# EAGLE design ledterne_driver (EAGLE 7.3.0)
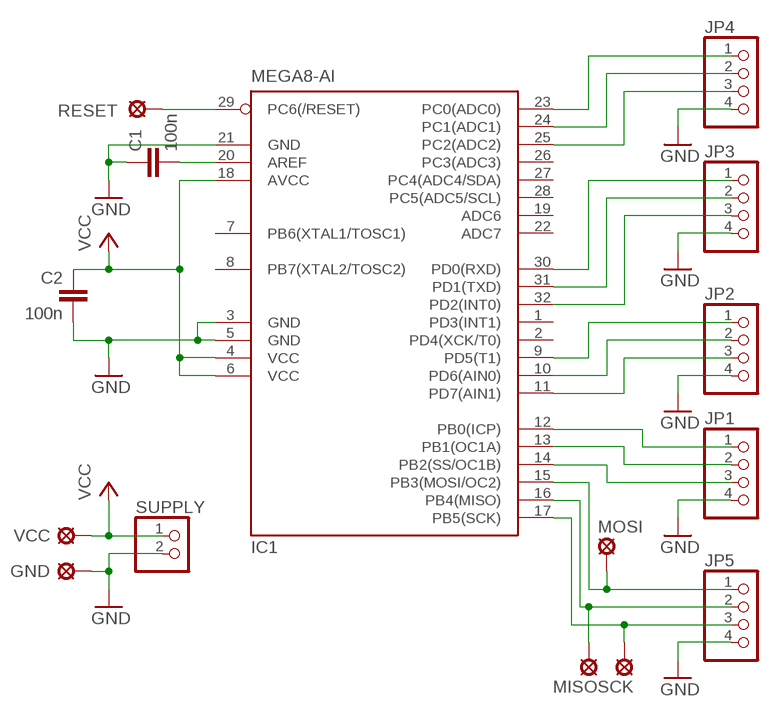
[diagram p0: schematic, sheet 1]

## Parts
C1  100n  C-EUC0805K  [C0805K]
C2  100n  C-EUC0805K  [C0805K]
GND  LSP10  [LSP10]
IC1  MEGA8-AI  [TQFP32-08]
JP1  PINHD-1X4/90  [1X04/90]
JP2  PINHD-1X4/90  [1X04/90]
JP3  PINHD-1X4/90  [1X04/90]
JP4  PINHD-1X4/90  [1X04/90]
JP5  PINHD-1X4/90  [1X04/90]
MISO  LSP10  [LSP10]
MOSI  LSP10  [LSP10]
RESET  LSP10  [LSP10]
SCK  LSP10  [LSP10]
SUPPLY  PINHD-1X2  [1X02]
VCC  LSP10  [LSP10]

## Nets
GND: C1.1 C2.2 GND.MP IC1.3(GND) IC1.5(GND) IC1.21(GND) JP1.4 JP2.4 JP3.4 JP4.4 JP5.4 SUPPLY.2
MISO: IC1.16(PB4(MISO)) JP5.2 MISO.MP
MOSI: IC1.15(PB3(MOSI/OC2)) JP5.1 MOSI.MP
N$1: C1.2 IC1.20(AREF)
N$3: IC1.14(PB2(SS/OC1B)) JP1.3
N$4: IC1.13(PB1(OC1A)) JP1.2
N$5: IC1.12(PB0(ICP)) JP1.1
N$6: IC1.11(PD7(AIN1)) JP2.3
N$7: IC1.10(PD6(AIN0)) JP2.2
N$8: IC1.9(PD5(T1)) JP2.1
N$9: IC1.30(PD0(RXD)) JP3.1
N$10: IC1.31(PD1(TXD)) JP3.2
N$11: IC1.32(PD2(INT0)) JP3.3
N$12: IC1.23(PC0(ADC0)) JP4.1
N$13: IC1.24(PC1(ADC1)) JP4.2
N$15: IC1.25(PC2(ADC2)) JP4.3
RESET: IC1.29(PC6(/RESET)) RESET.MP
SCK: IC1.17(PB5(SCK)) JP5.3 SCK.MP
VCC: C2.1 IC1.4(VCC) IC1.6(VCC) IC1.18(AVCC) SUPPLY.1 VCC.MP
Unconnected: IC1.1(PD3(INT1)) IC1.2(PD4(XCK/T0)) IC1.7(PB6(XTAL1/TOSC1)) IC1.8(PB7(XTAL2/TOSC2)) IC1.19(ADC6) IC1.22(ADC7) IC1.26(PC3(ADC3)) IC1.27(PC4(ADC4/SDA)) IC1.28(PC5(ADC5/SCL))

## Library data of the parts
C1 C2 = rcl:C-EU: CAPACITOR, European symbol
GND MISO MOSI RESET SCK VCC = solpad-ledterne:LSP10
IC1 = atmel:MEGA8: MICROCONTROLLER 8 Kbytes FLASH, 1 kbytes SRAM, 512 bytes EEPROM, USART, 6-channel 10 bit ADC, 2-channel 8 bit ADC Pin compatible with Atmega48, ATMega88, ATMega168 Source: avr.lbr; MPN: ATMEGA8-16AU; OC_FARNELL: 9171371; OC_NEWARK: 73M8863
JP1-JP5 = pinhead_round_pads:PINHD-1X4: PIN HEADER
SUPPLY = pinhead:PINHD-1X2: PIN HEADER

## Board
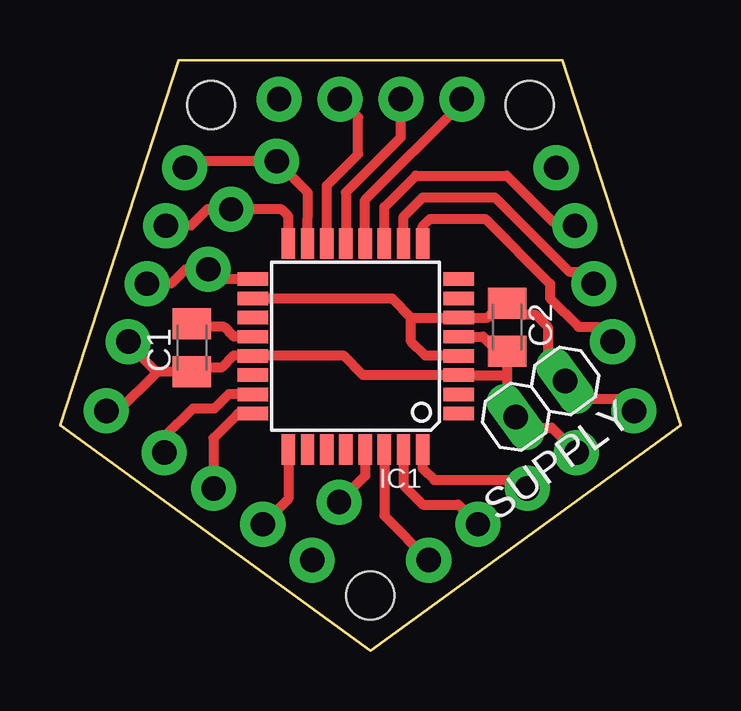
[diagram p1: board, top side]
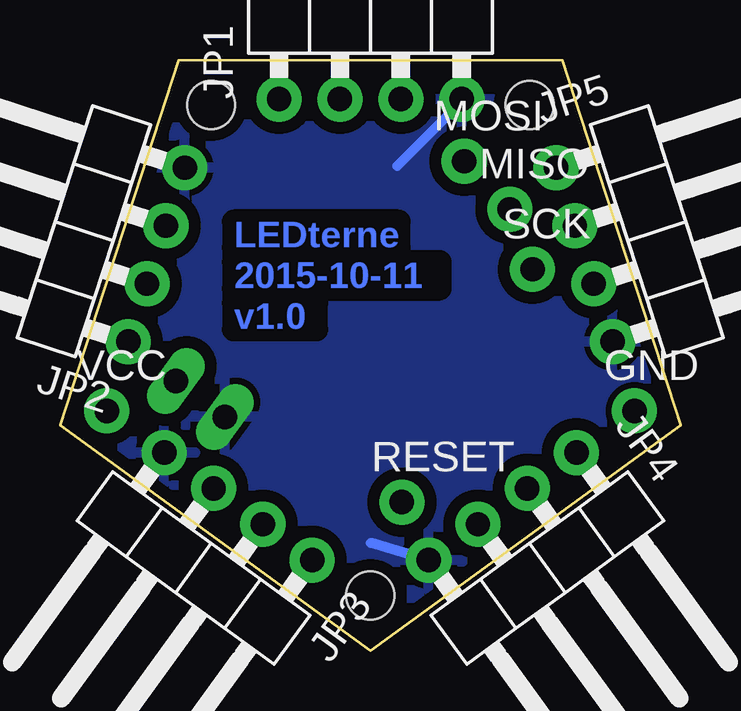
[diagram p2: board, bottom side, seen from below]

Size 25.89 x 24.62 mm. Coordinates in mm from the lower left corner, seen from the top.
Outline: 12.94,0 25.89,9.4 20.94,24.62 4.94,24.62 0,9.4 12.94,0
Copper layers (1*16): Top 0.035mm / dielectric 1.5mm / Bottom 0.035mm
Design rules "default *": minimum track width 10mil, minimum drill 24mil, track to track 8mil, track to pad 8mil, pad to pad 8mil, via to via 8mil, smd to smd 8mil, copper to edge 15mil, drill to drill 8mil, minimum pad ring 10mil, minimum via ring 8mil, stop-mask expansion 4mil, vias tented up to drill 0mil, thermal gap 10mil
Holes 2 mm at 19.59,22.75 12.94,2.31 6.3,22.75
bRestrict: area 1.2,9.3 to 2.6,10.7; area 5.5,15.2 to 6.9,16.6; area 6.4,17.7 to 7.8,19.1; area 8.3,19.7 to 9.7,21.1; area 10.9,5.5 to 12.3,6.9; area 23.2,9.3 to 24.6,10.7

### Footprints (pad centres in the part's own frame; a part is rotated, then mirrored left to right if it is on the bottom)
C0805K = smd 1.3 x 1.6: 1 -1,0; 2 1,0
LSP10 = drill 1.016 pad 1.88: MP 0,0
TQFP32-08 = smd 1.27 x 0.559: 1 -4.293,2.8; 2 -4.293,2; 3 -4.293,1.2; 4 -4.293,0.4; 5 -4.293,-0.4; 6 -4.293,-1.2; 7 -4.293,-2; 8 -4.293,-2.8; 17 4.293,-2.8; 18 4.293,-2; 19 4.293,-1.2; 20 4.293,-0.4; 21 4.293,0.4; 22 4.293,1.2; 23 4.293,2; 24 4.293,2.8 | smd 0.559 x 1.27: 9 -2.8,-4.293; 10 -2,-4.293; 11 -1.2,-4.293; 12 -0.4,-4.293; 13 0.4,-4.293; 14 1.2,-4.293; 15 2,-4.293; 16 2.8,-4.293; 25 2.8,4.293; 26 2,4.293; 27 1.2,4.293; 28 0.4,4.293; 29 -0.4,4.293; 30 -1.2,4.293; 31 -2,4.293; 32 -2.8,4.293
1X04/90 = drill 1.016 pad 1.88: 1 -3.81,-3.81; 2 -1.27,-3.81; 3 1.27,-3.81; 4 3.81,-3.81
1X02 = drill 1.016 long: 1 -1.27,0; 2 1.27,0

### Placement (x,y rotation side)
C1  5.5,12.63 90 top
C2  18.64,13.49 270 top
GND  1.93,10 0 bottom
IC1  12.32,12.69 180 top
JP1  12.94,26.8 0 bottom
JP2  25.49,17.69 72 bottom
JP3  20.7,2.94 144 bottom
JP4  5.19,2.94 216 bottom
JP5  0.4,17.69 288 bottom
MISO  7.13,18.4 0 bottom
MOSI  9.03,20.4 0 bottom
RESET  11.63,6.2 0 bottom
SCK  6.18,15.9 0 bottom
SUPPLY  20.03,10.5 216 top
VCC  23.93,10 0 bottom

### Tracks (layer width: path | path; a pad name or v marks a point on that pad's centre or on a via)
GND
  Top 0.406: 18.64,11.4 C2.2 18.56,12.7 18.03,12.7 17.64,13.09 IC1.5 | 18.64,11.4 18.64,10.12 SUPPLY.2 19.46,9.3 20.5,9.3 JP3.4 | 18.64,11.4 18.55,11.49 IC1.3 12.64,11.49 11.84,12.29 IC1.21 7.22,12.29 6.73,11.8 6.23,11.8 6.03,12 5.75,12 C1.1 4,11.63 | GND.MP 2.43,10 4.03,11.6 4,11.63 | 2.83,12.8 4,11.63
  Bottom 0.406: JP1.4 9.13,22.9 11.83,20.2 | JP4.4 12.93,4.5
  pour Bottom (isolate 0.5): 4.93,24.6 20.93,24.6 25.83,9.5 12.93,0 0.03,9.4
MISO
  Top 0.406: IC1.16 9.52,18.11 9.23,18.4 MISO.MP 6.13,18.4 5.45,17.72 JP5.2
MOSI
  Top 0.406: JP5.1 5.49,20.4 MOSI.MP 10.33,19.08 IC1.15
N$1
  Top 0.406: 5.82,13.29 C1.2 5.63,13.5 6.83,13.5 7.24,13.09 IC1.20
N$3
  Top 0.406: IC1.14 11.12,19.39 12.43,20.7 12.43,22.23 JP1.3
N$4
  Top 0.406: IC1.13 11.92,19.11 14.21,21.4 JP1.2
N$5
  Top 0.406: IC1.12 12.72,18.79 16.75,22.82 JP1.1
N$6
  Top 0.406: IC1.11 13.52,18.49 14.83,19.8 18.63,19.8 20.53,17.9 21.29,17.9 JP2.3
N$7
  Top 0.406: IC1.10 14.32,18.09 15.13,18.9 18.13,18.9 21.23,15.8 21.76,15.8 JP2.2
N$8
  Top 0.406: IC1.9 15.12,17.69 15.43,18 17.73,18 20.43,15.3 20.43,14.7 21.63,13.5 22.43,13.5 JP2.1
N$9
  Top 0.406: IC1.30 13.52,5.63 JP3.1
N$10
  Top 0.406: IC1.31 14.32,6.91 15.13,6.1 16.61,6.1 JP3.2
N$11
  Top 0.406: IC1.32 15.12,7.61 15.61,7.13 19.13,7.13 JP3.3
N$12
  Top 0.406: IC1.23 8.02,10.7 7.03,10.7 6.43,10.1 5.53,10.1 4.35,8.92 JP4.1
N$13
  Top 0.406: IC1.24 7.42,9.89 6.4,8.87 JP4.2
N$15
  Top 0.406: IC1.25 9.52,6.34 JP4.3
RESET
  Top 0.406: IC1.29 12.72,7.29 RESET.MP
SCK
  Top 0.406: IC1.17 6.59,15.49 SCK.MP 5.23,15.9 4.63,15.3 JP5.3
VCC
  Top 0.406: IC1.18 13.84,14.69 14.64,13.89 | 14.64,13.89 IC1.6 17.82,13.89 18.13,14.2 18.48,14.2 | IC1.4 15.23,12.3 14.64,12.89 14.64,13.89 | 18.48,14.2 C2.1 | 18.48,14.2 19.13,14.2 19.33,14 19.83,14 20.33,13.5 20.33,11.97 SUPPLY.1 21.81,10.5 23.43,10.5 VCC.MP

### Text on the board
Bottom: LEDterne | 2015-10-11 | v1.0
Measures: 16 mm